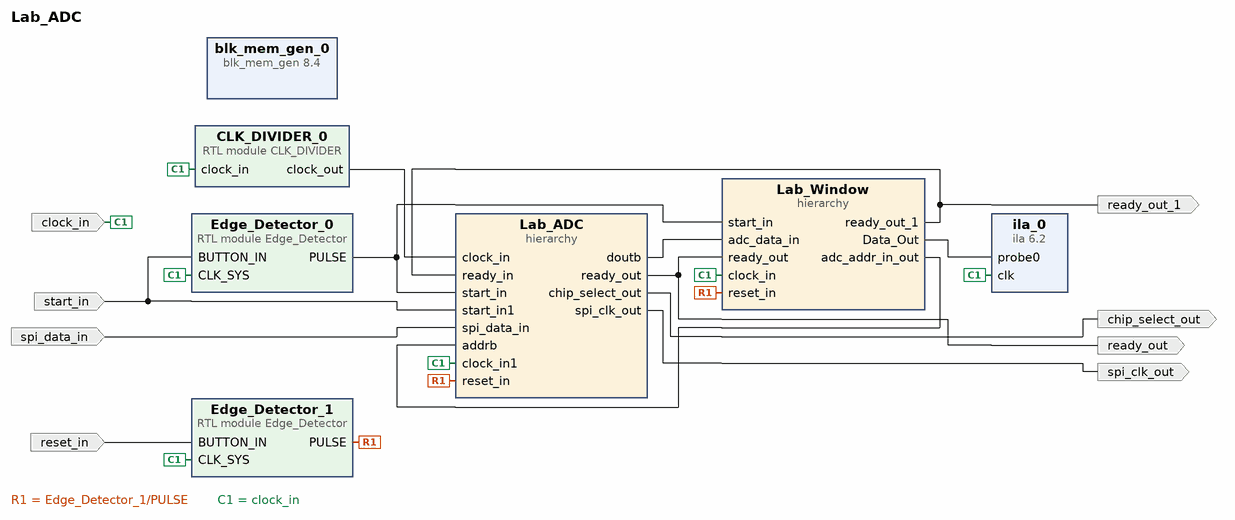
[diagram p0: block diagram of the top level]
# Vivado block design Lab_ADC, xc7a35tcpg236-1, Vivado 2019.1
create_bd_design Lab_ADC

create_bd_port -dir O chip_select_out
create_bd_port -dir I -type clk clock_in
set_property -dict {CONFIG.FREQ_HZ 100000000} [get_bd_ports clock_in]
create_bd_port -dir I reset_in
create_bd_port -dir O spi_clk_out
create_bd_port -dir I -type data spi_data_in
create_bd_port -dir I start_in
create_bd_port -dir O ready_out
create_bd_port -dir O ready_out_1

create_bd_cell -type module -reference CLK_DIVIDER CLK_DIVIDER_0
create_bd_cell -type module -reference Edge_Detector Edge_Detector_0
create_bd_cell -type module -reference Edge_Detector Edge_Detector_1
create_bd_cell -type hier Lab_Window
create_bd_cell -type hier Lab_ADC
create_bd_cell -type ip -vlnv xilinx.com:ip:ila:6.2 ila_0
set_property -dict [list \
  CONFIG.C_DATA_DEPTH 16384 \
  CONFIG.C_ENABLE_ILA_AXI_MON false \
  CONFIG.C_MONITOR_TYPE Native \
  CONFIG.C_NUM_OF_PROBES 1 \
  CONFIG.C_PROBE0_WIDTH 20 \
] [get_bd_cells ila_0]
create_bd_cell -type ip -vlnv xilinx.com:ip:blk_mem_gen:8.4 blk_mem_gen_0
set_property -dict [list \
  CONFIG.Coe_File ../../../../../../files/dummy_voice_signal_2.coe \
  CONFIG.Enable_32bit_Address false \
  CONFIG.Enable_A Use_ENA_Pin \
  CONFIG.Load_Init_File true \
  CONFIG.Read_Width_A 16 \
  CONFIG.Register_PortA_Output_of_Memory_Primitives true \
  CONFIG.Use_Byte_Write_Enable false \
  CONFIG.Use_RSTA_Pin false \
  CONFIG.Write_Depth_A 16384 \
  CONFIG.Write_Width_A 16 \
  CONFIG.use_bram_block Stand_Alone \
] [get_bd_cells blk_mem_gen_0]

# ---- hierarchy /Lab_Window ----
current_bd_instance /Lab_Window
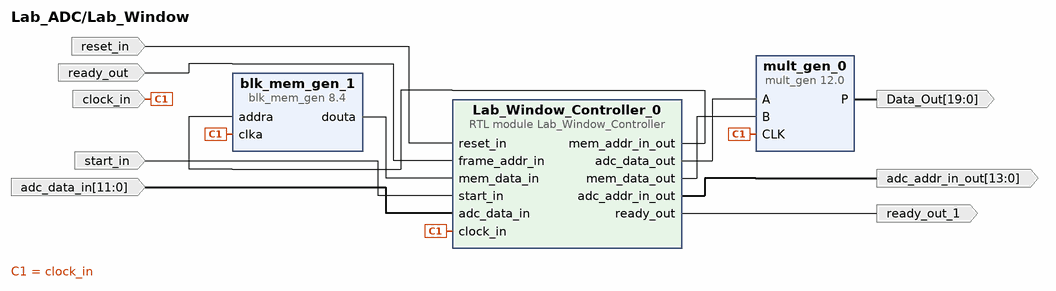
[diagram p1: block diagram inside /Lab_Window]
create_bd_pin -dir I -type rst reset_in
create_bd_pin -dir I -type clk clock_in
create_bd_pin -dir I ready_out
create_bd_pin -dir I start_in
create_bd_pin -dir O ready_out_1
create_bd_pin -dir O -from 19 -to 0 -type data Data_Out
create_bd_pin -dir O -from 13 -to 0 adc_addr_in_out
create_bd_pin -dir I -from 11 -to 0 adc_data_in

create_bd_cell -type ip -vlnv xilinx.com:ip:blk_mem_gen:8.4 blk_mem_gen_1
set_property -dict [list \
  CONFIG.Coe_File ../../../../../../files/hanning_coefficients.coe \
  CONFIG.Enable_32bit_Address false \
  CONFIG.Enable_A Always_Enabled \
  CONFIG.Load_Init_File true \
  CONFIG.Memory_Type Single_Port_ROM \
  CONFIG.Port_A_Write_Rate 0 \
  CONFIG.Register_PortA_Output_of_Memory_Primitives false \
  CONFIG.Use_RSTA_Pin false \
  CONFIG.Write_Depth_A 512 \
  CONFIG.Write_Width_A 8 \
  CONFIG.use_bram_block Stand_Alone \
] [get_bd_cells blk_mem_gen_1]
create_bd_cell -type ip -vlnv xilinx.com:ip:mult_gen:12.0 mult_gen_0
set_property -dict [list \
  CONFIG.Multiplier_Construction Use_Mults \
  CONFIG.PortAType Unsigned \
  CONFIG.PortAWidth 12 \
  CONFIG.PortBType Unsigned \
  CONFIG.PortBWidth 8 \
] [get_bd_cells mult_gen_0]
create_bd_cell -type module -reference Lab_Window_Controller Lab_Window_Controller_0

# ---- hierarchy /Lab_ADC ----
current_bd_instance /Lab_ADC
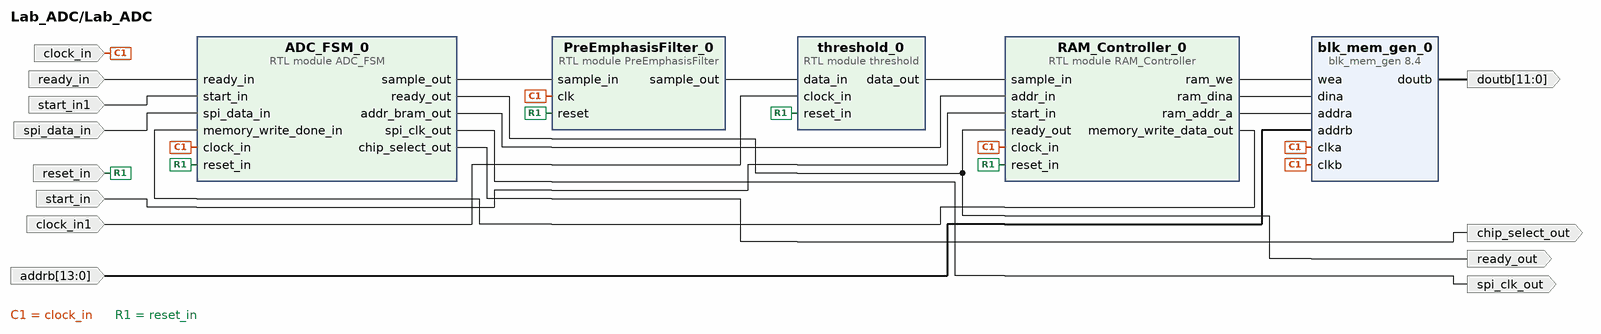
[diagram p2: block diagram inside /Lab_ADC]
create_bd_pin -dir I -type clk clock_in
create_bd_pin -dir I -type rst reset_in
create_bd_pin -dir I start_in
create_bd_pin -dir I -type clk clock_in1
create_bd_pin -dir I -from 13 -to 0 addrb
create_bd_pin -dir O -from 11 -to 0 doutb
create_bd_pin -dir I ready_in
create_bd_pin -dir I start_in1
create_bd_pin -dir O spi_clk_out
create_bd_pin -dir I spi_data_in
create_bd_pin -dir O ready_out
create_bd_pin -dir O chip_select_out

create_bd_cell -type module -reference RAM_Controller RAM_Controller_0
create_bd_cell -type module -reference threshold threshold_0
create_bd_cell -type ip -vlnv xilinx.com:ip:blk_mem_gen:8.4 blk_mem_gen_0
set_property -dict [list \
  CONFIG.Enable_32bit_Address false \
  CONFIG.Enable_A Always_Enabled \
  CONFIG.Enable_B Always_Enabled \
  CONFIG.Memory_Type Simple_Dual_Port_RAM \
  CONFIG.Operating_Mode_A NO_CHANGE \
  CONFIG.Port_B_Clock 100 \
  CONFIG.Port_B_Enable_Rate 100 \
  CONFIG.Read_Width_B 12 \
  CONFIG.Register_PortB_Output_of_Memory_Primitives false \
  CONFIG.Use_Byte_Write_Enable false \
  CONFIG.Write_Depth_A 16384 \
  CONFIG.Write_Width_A 12 \
  CONFIG.Write_Width_B 12 \
  CONFIG.use_bram_block Stand_Alone \
] [get_bd_cells blk_mem_gen_0]
create_bd_cell -type module -reference ADC_FSM ADC_FSM_0
create_bd_cell -type module -reference PreEmphasisFilter PreEmphasisFilter_0

# ---- connections ----

current_bd_instance /Lab_Window
connect_bd_net [get_bd_pins Lab_Window_Controller_0/adc_data_out] [get_bd_pins mult_gen_0/A]
connect_bd_net [get_bd_pins Lab_Window_Controller_0/mem_addr_in_out] [get_bd_pins blk_mem_gen_1/addra]
connect_bd_net [get_bd_pins blk_mem_gen_1/douta] [get_bd_pins Lab_Window_Controller_0/mem_data_in]
connect_bd_net [get_bd_pins Lab_Window_Controller_0/mem_data_out] [get_bd_pins mult_gen_0/B]
connect_bd_net -net Edge_Detector_1_PULSE [get_bd_pins reset_in] [get_bd_pins Lab_Window_Controller_0/reset_in]
connect_bd_net [get_bd_pins clock_in] [get_bd_pins blk_mem_gen_1/clka] [get_bd_pins mult_gen_0/CLK] [get_bd_pins Lab_Window_Controller_0/clock_in]
connect_bd_net -net ADC_FSM_0_ready_out [get_bd_pins ready_out] [get_bd_pins Lab_Window_Controller_0/frame_addr_in]
connect_bd_net -net Edge_Detector_0_PULSE [get_bd_pins start_in] [get_bd_pins Lab_Window_Controller_0/start_in]
connect_bd_net [get_bd_pins Lab_Window_Controller_0/ready_out] [get_bd_pins ready_out_1]
connect_bd_net [get_bd_pins mult_gen_0/P] [get_bd_pins Data_Out]
connect_bd_net [get_bd_pins Lab_Window_Controller_0/adc_addr_in_out] [get_bd_pins adc_addr_in_out]
connect_bd_net [get_bd_pins adc_data_in] [get_bd_pins Lab_Window_Controller_0/adc_data_in]

current_bd_instance /Lab_ADC
connect_bd_net [get_bd_pins threshold_0/data_out] [get_bd_pins RAM_Controller_0/sample_in]
connect_bd_net -net CLK_DIVIDER_0_clock_out [get_bd_pins clock_in] \
  [get_bd_pins RAM_Controller_0/clock_in] [get_bd_pins blk_mem_gen_0/clkb] [get_bd_pins blk_mem_gen_0/clka] \
  [get_bd_pins ADC_FSM_0/clock_in] [get_bd_pins PreEmphasisFilter_0/clk]
connect_bd_net -net Edge_Detector_1_PULSE [get_bd_pins reset_in] \
  [get_bd_pins RAM_Controller_0/reset_in] [get_bd_pins threshold_0/reset_in] [get_bd_pins ADC_FSM_0/reset_in] \
  [get_bd_pins PreEmphasisFilter_0/reset]
connect_bd_net -net Edge_Detector_0_PULSE [get_bd_pins start_in] [get_bd_pins RAM_Controller_0/start_in]
connect_bd_net [get_bd_pins clock_in1] [get_bd_pins threshold_0/clock_in]
connect_bd_net [get_bd_pins RAM_Controller_0/ram_we] [get_bd_pins blk_mem_gen_0/wea]
connect_bd_net [get_bd_pins addrb] [get_bd_pins blk_mem_gen_0/addrb]
connect_bd_net [get_bd_pins blk_mem_gen_0/doutb] [get_bd_pins doutb]
connect_bd_net [get_bd_pins RAM_Controller_0/ram_dina] [get_bd_pins blk_mem_gen_0/dina]
connect_bd_net [get_bd_pins RAM_Controller_0/ram_addr_a] [get_bd_pins blk_mem_gen_0/addra]
connect_bd_net [get_bd_pins ready_in] [get_bd_pins ADC_FSM_0/ready_in]
connect_bd_net [get_bd_pins ADC_FSM_0/ready_out] [get_bd_pins RAM_Controller_0/ready_out] [get_bd_pins ready_out]
connect_bd_net [get_bd_pins ADC_FSM_0/addr_bram_out] [get_bd_pins RAM_Controller_0/addr_in]
connect_bd_net -net start_in1_1 [get_bd_pins start_in1] [get_bd_pins ADC_FSM_0/start_in]
connect_bd_net [get_bd_pins ADC_FSM_0/spi_clk_out] [get_bd_pins spi_clk_out]
connect_bd_net [get_bd_pins spi_data_in] [get_bd_pins ADC_FSM_0/spi_data_in]
connect_bd_net [get_bd_pins ADC_FSM_0/chip_select_out] [get_bd_pins chip_select_out]
connect_bd_net [get_bd_pins RAM_Controller_0/memory_write_data_out] [get_bd_pins ADC_FSM_0/memory_write_done_in]
connect_bd_net [get_bd_pins PreEmphasisFilter_0/sample_out] [get_bd_pins threshold_0/data_in]
connect_bd_net [get_bd_pins ADC_FSM_0/sample_out] [get_bd_pins PreEmphasisFilter_0/sample_in]

current_bd_instance /
connect_bd_net [get_bd_pins CLK_DIVIDER_0/clock_out] [get_bd_pins Lab_ADC/clock_in]
connect_bd_net [get_bd_pins Edge_Detector_0/PULSE] [get_bd_pins Lab_Window/start_in] [get_bd_pins Lab_ADC/start_in]
connect_bd_net [get_bd_pins Edge_Detector_1/PULSE] [get_bd_pins Lab_Window/reset_in] [get_bd_pins Lab_ADC/reset_in]
connect_bd_net [get_bd_ports clock_in] \
  [get_bd_pins CLK_DIVIDER_0/clock_in] [get_bd_pins Edge_Detector_0/CLK_SYS] [get_bd_pins Edge_Detector_1/CLK_SYS] \
  [get_bd_pins Lab_Window/clock_in] [get_bd_pins Lab_ADC/clock_in1] [get_bd_pins ila_0/clk]
connect_bd_net [get_bd_ports reset_in] [get_bd_pins Edge_Detector_1/BUTTON_IN]
connect_bd_net [get_bd_ports start_in] [get_bd_pins Edge_Detector_0/BUTTON_IN] [get_bd_pins Lab_ADC/start_in1]
connect_bd_net -net Lab_Window_Controller_0_ready_out [get_bd_pins Lab_Window/ready_out_1] [get_bd_ports ready_out_1] [get_bd_pins Lab_ADC/ready_in]
connect_bd_net -net mult_gen_0_P [get_bd_pins Lab_Window/Data_Out] [get_bd_pins ila_0/probe0]
connect_bd_net [get_bd_pins Lab_Window/adc_addr_in_out] [get_bd_pins Lab_ADC/addrb]
connect_bd_net -net adc_data_in_1 [get_bd_pins Lab_ADC/doutb] [get_bd_pins Lab_Window/adc_data_in]
connect_bd_net -net ADC_FSM_0_ready_out1 [get_bd_pins Lab_ADC/ready_out] [get_bd_ports ready_out] [get_bd_pins Lab_Window/ready_out]
connect_bd_net [get_bd_pins Lab_ADC/spi_clk_out] [get_bd_ports spi_clk_out]
connect_bd_net [get_bd_ports spi_data_in] [get_bd_pins Lab_ADC/spi_data_in]
connect_bd_net [get_bd_pins Lab_ADC/chip_select_out] [get_bd_ports chip_select_out]

validate_bd_design
save_bd_design
